# Altium schematic sheet processor.SchDoc
size A4
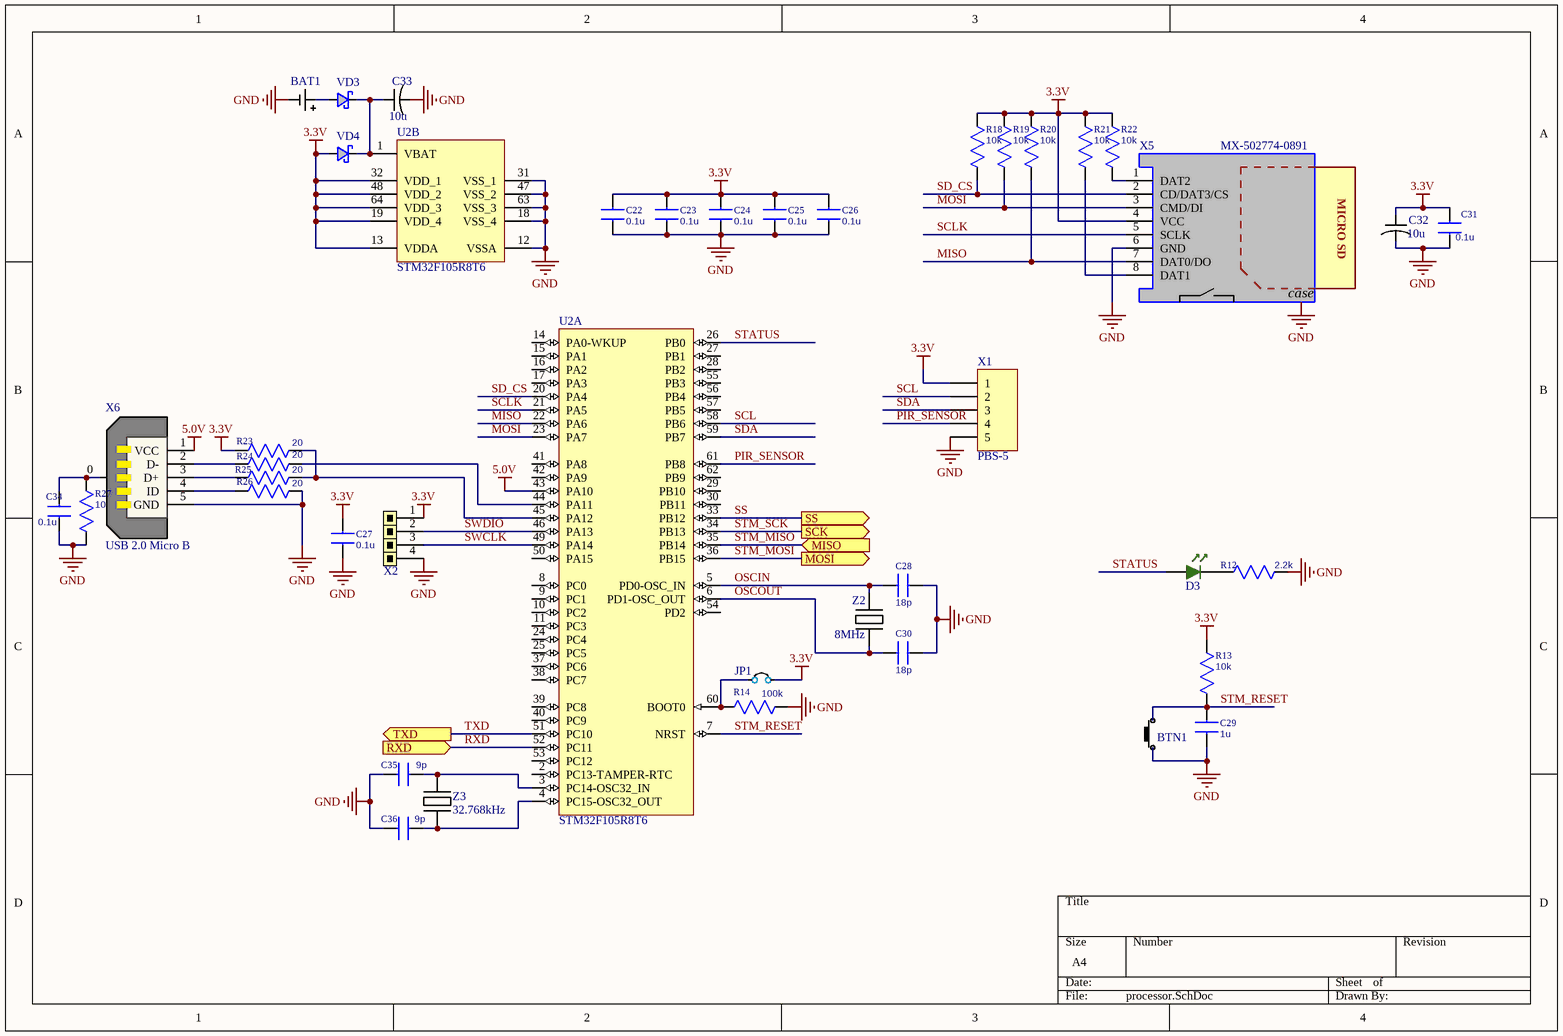
[diagram p0: processor.SchDoc]

## Parts
BAT1  Battery  [S8411-45R]  (value not drawn)
BTN1  Push Button  [PUSH BUTTON RIGHT ANGLE]  (value not drawn)
C22  0.1u  [C_0603]
C23  0.1u  [C_0603]
C24  0.1u  [C_0603]
C25  0.1u  [C_0603]
C26  0.1u  [C_0603]
C27  0.1u  [C_0603]
C28  18p  [C_0603]
C29  1u  [C_0603]
C30  18p  [C_0603]
C31  0.1u  [C_0603]
C32  10u  [TANTALUM_CAP_SIZE_A]
C33  10u  [TANTALUM_CAP_SIZE_A]
C34  0.1u  [C_0603]
C35  9p  [C_0603]
C36  9p  [C_0603]
D3  LED Green  [LED GREEN 3MM]  (value not drawn)
JP1  PLS-2  [PLS-2]  (value not drawn)
R12  2.2k  [R_0603]
R13  10k  [R_0603]
R14  100k  [R_0603]
R18  10k  [R_0603]
R19  10k  [R_0603]
R20  10k  [R_0603]
R21  10k  [R_0603]
R22  10k  [R_0603]
R23  20  [R_0603]
R24  20  [R_0603]
R25  20  [R_0603]
R26  20  [R_0603]
R27  10  [R_0603]
U2  STM32F105R8T6  [STM-LQFP64_N]  (parts A,B of 2)
VD3  Schottky Diode  [DO-214AA]  (value not drawn)
VD4  Schottky Diode  [DO-214AA]  (value not drawn)
X1  PBS-5  [PBS-5-3D]
X2  PLS-4  [PLS-4]  (value not drawn)
X5  MX-502774-0891  [MICRO SD SOCKET 2]
X6  USB 2.0 Micro B  [USB 2.0 MICRO B]
Z2  8MHz  [HC-49]
Z3  32.768kHz  [ST2012SB]

## Ports
MISO (in), MOSI (out), RXD (in), SCK (out), SS (out), TXD (out)

## Nets
3.3V: C22.1 C23.1 C24.1 C25.1 C26.1 C27.1 C31.1 C32.1 JP1.2 R13.1 R18.2 R19.2 R20.2 R21.2 R22.2 R23.1 U2.13(VDDA) U2.19(VDD_4) U2.32(VDD_1) U2.48(VDD_2) U2.64(VDD_3) VD4.A X1.1 X2.1 X5.4(VCC)
5.0V: U2.43(PA10) X6.1(VCC)
GND: BAT1.- BTN1.2 C22.2 C23.2 C24.2 C25.2 C26.2 C27.2 C28.1 C29.1 C30.1 C31.2 C32.2 C33.2 C34.2 C35.1 C36.1 R12.2 R14.1 R26.2 R27.2 U2.12(VSSA) U2.18(VSS_4) U2.31(VSS_1) U2.47(VSS_2) U2.63(VSS_3) X1.5 X2.4 X5.0(PCK) X5.6(GND) X6.5(GND)
MISO: R20.1 U2.22(PA6) X5.7(DAT0/DO)
MOSI: R19.1 U2.23(PA7) X5.3(CMD/DI)
OSCIN: C28.2 U2.5(PD0-OSC_IN) Z2.2
OSCOUT: C30.2 U2.6(PD1-OSC_OUT) Z2.1
PIR_SENSOR: U2.61(PB8) X1.4
RXD: U2.52(PC11) ; port RXD
SCL: U2.58(PB6) X1.2
SCLK: U2.21(PA5) X5.5(SCLK)
SD_CS: R18.1 U2.20(PA4) X5.2(CD/DAT3/CS)
SDA: U2.59(PB7) X1.3
SS: U2.33(PB12) ; port SS
STATUS: D3.A U2.26(PB0)
STM_MISO: U2.35(PB14) ; port MISO
STM_MOSI: U2.36(PB15) ; port MOSI
STM_RESET: BTN1.1 C29.2 R13.2 U2.7(NRST)
STM_SCK: U2.34(PB13) ; port SCK
SWCLK: U2.49(PA14) X2.3
SWDIO: U2.46(PA13) X2.2
TXD: U2.51(PC10) ; port TXD
NetBAT1_+: BAT1.+ VD3.A
NetC33_1: C33.1 U2.1(VBAT) VD3.C VD4.C
NetC34_1: C34.1 R27.1 X6.0
NetC35_2: C35.2 U2.3(PC14-OSC32_IN) Z3.2
NetC36_2: C36.2 U2.4(PC15-OSC32_OUT) Z3.1
NetD3_C: D3.C R12.1
NetJP1_1: JP1.1 R14.2 U2.60(BOOT0)
NetR21_1: R21.1 X5.8(DAT1)
NetR22_1: R22.1 X5.1(DAT2)
NetR23_2: R23.2 R25.1 U2.45(PA12)
NetR24_1: R24.1 U2.44(PA11)
NetR24_2: R24.2 X6.2(D-)
NetR25_2: R25.2 X6.3(D+)
NetR26_1: R26.1 X6.4(ID)

Not connected (* = marked no-connect by the designer): U2 2(PC13-TAMPER-RTC) 8(PC0) 9(PC1) 10(PC2) 11(PC3) 14(PA0-WKUP) 15(PA1) 16(PA2) 17(PA3) 24(PC4) 25(PC5) 27(PB1) 28(PB2) 29(PB10) 30(PB11) 37(PC6) 38(PC7) 39(PC8) 40(PC9) 41(PA8) 42(PA9) 50(PA15) 53(PC12) 54(PD2) 55(PB3) 56(PB4) 57(PB5) 62(PB9); X5 9(SW1) 10(SW2)

## Notes on the sheet
- (in symbol Micro SD socket) MICRO SD; case

## Library data of the parts
C22-C31 C34-C36 = C0603: Capacitor
  C22-C27 C31 C34: Value: 0.1u
  C28 C30: Value: 18p
  C29: Value: 1u
  C35 C36: Value: 9p
C32 C33 = Tantalum Capacitor
JP1 = JP-2: Jumper Pins; Type: PLS-2
R12-R14 R18-R27 = R0603: Resistor
  R12: Value: 2.2k
  R13 R18-R22: Value: 10k
  R14: Value: 100k
  R23-R26: Value: 20
  R27: Value: 10
U2 = STM32F105R8T6: ARM Cortex-M3 32-bit MCU, 64 KB Flash, 64 KB Internal RAM, 51 I/Os, 64-pin LQFP, -40 to 85 degC, Tray; A/D Converter: 2x12-bit (16 Channel); D/A Converter: 2x12-bit (2 Channel); FLASH Size (Prog) (kB): 64; I/Os (High Current): 51; Operating Frequency(F) (Processor speed) (MHz): 72; Supply Voltage(Vcc) min (V): 2; DatasheetVersion: Rev. 6; PackageVersion: Rev. 4, 06/2013; PackageReference: LQFP64; PackageDescription: 64-Pin Low Profile Quad Flat Package, 10 x 10 mm Body, 0.5 mm Pitch; Supplier 1: Digi-Key; Supplier Part Number 1: 497-8922-ND; Supplier 2: Farnell; Supplier Part Number 2: 1737131; Supplier 3: Newark; Supplier Part Number 3: 52R2327; Supplier 4: Newark; Supplier Part Number 4: 25R9439; Supplier 5: Mouser; Supplier Part Number 5: 511-STM32F105R8T6; Core: ARM Cortex-M3; Internal RAM Size (kB): 64; Packing: Tray; Mounting Technology: Surface Mount; PartNumber: STM32F105R8T6; ComponentLink1Description: Manufacturer URL; ComponentLink1URL: http://www.st.com/web/en/home.html; ComponentLink2Description: Datasheet; ComponentLink2URL: http://www.st.com/st-web-ui/static/active/en/resource/technical/document/datasheet/CD00220364.pdf; ComponentLink3Description: Package Specification; ComponentLink3URL: http://www.st.com/st-web-ui/static/active/en/resource/technical/document/datasheet/DM00037051.pdf
VD3 VD4 = Schottky: SCHOTTKY BARRIER RECTIFIER
X1 = PBS-5: Header, 5-Pin; LatestRevisionDate: 17-Jul-2002; LatestRevisionNote: Re-released for DXP Platform.; Publisher: Altium Limited
X5 = Micro SD socket
Z2 Z3 = XTAL: Quartz resonator